# Altium schematic sheet Host_FPGA.SchDoc: Host Controller - Spartan3-1500
size A2; Organization: Altium Limited.; Address1: Level 3, 12a Rodborough Rd; Address2: Frenchs Forest 2086; Address3: NSW; Address4: AUSTRALIA; DocumentNumber: 12; Revision: 6; SheetNumber: 12; SheetTotal: 64; PageSetup: Record=PageOptions|CenterHorizontal=True|CenterVertical=True|PrintScale=0.47|XCorrection=1.00|YCorrection=1.00|PrintKind=0|BorderSize=5000000|LeftOffset=0|BottomOffset=0|Orientation=2|PaperLength=1000|PaperWidth=1000|Scale=100|PaperSource=7|PrintQuality=1200|MediaType=1|DitherType=10|PaperKind=A4 (210 x 297 mm)|PrintScaleMode=1
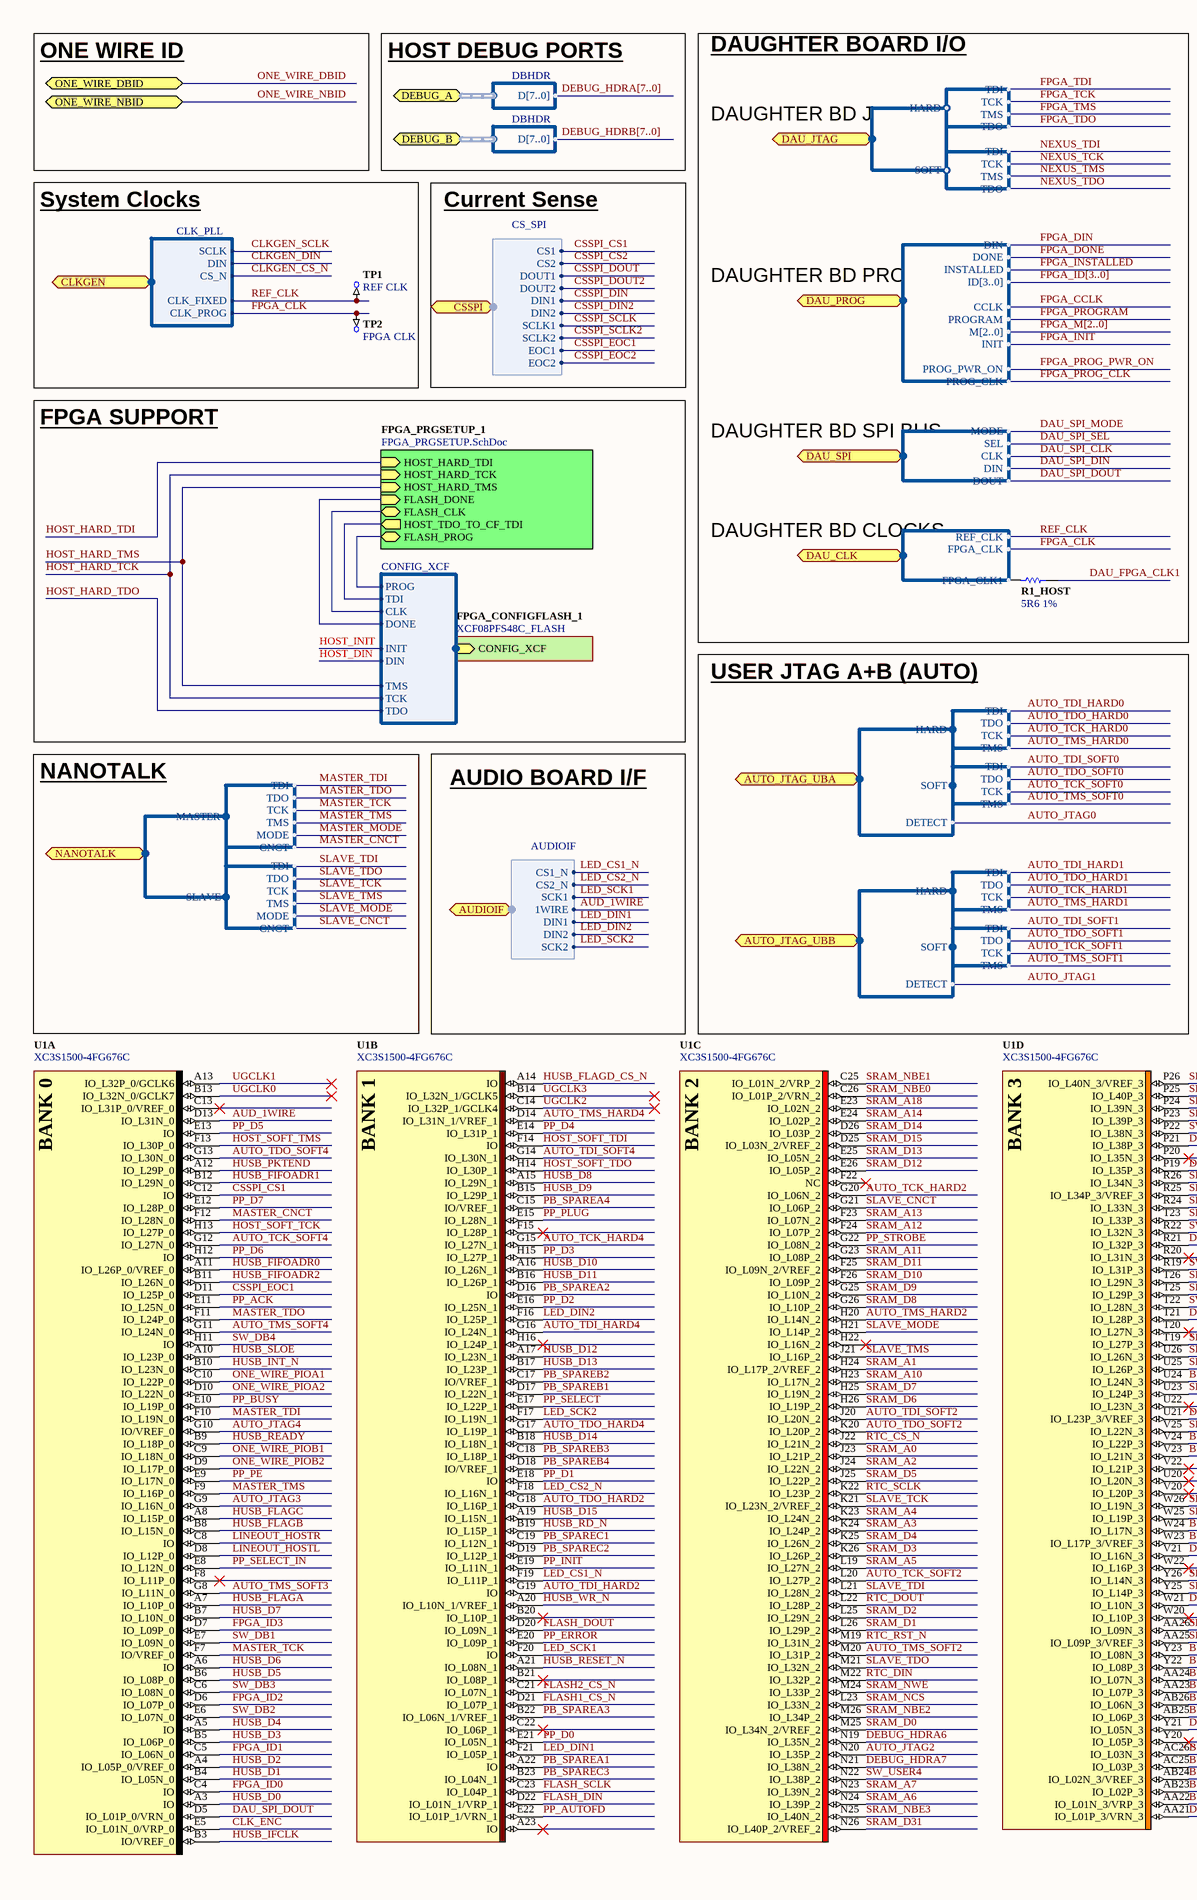
[diagram p0: Host_FPGA.SchDoc, left]
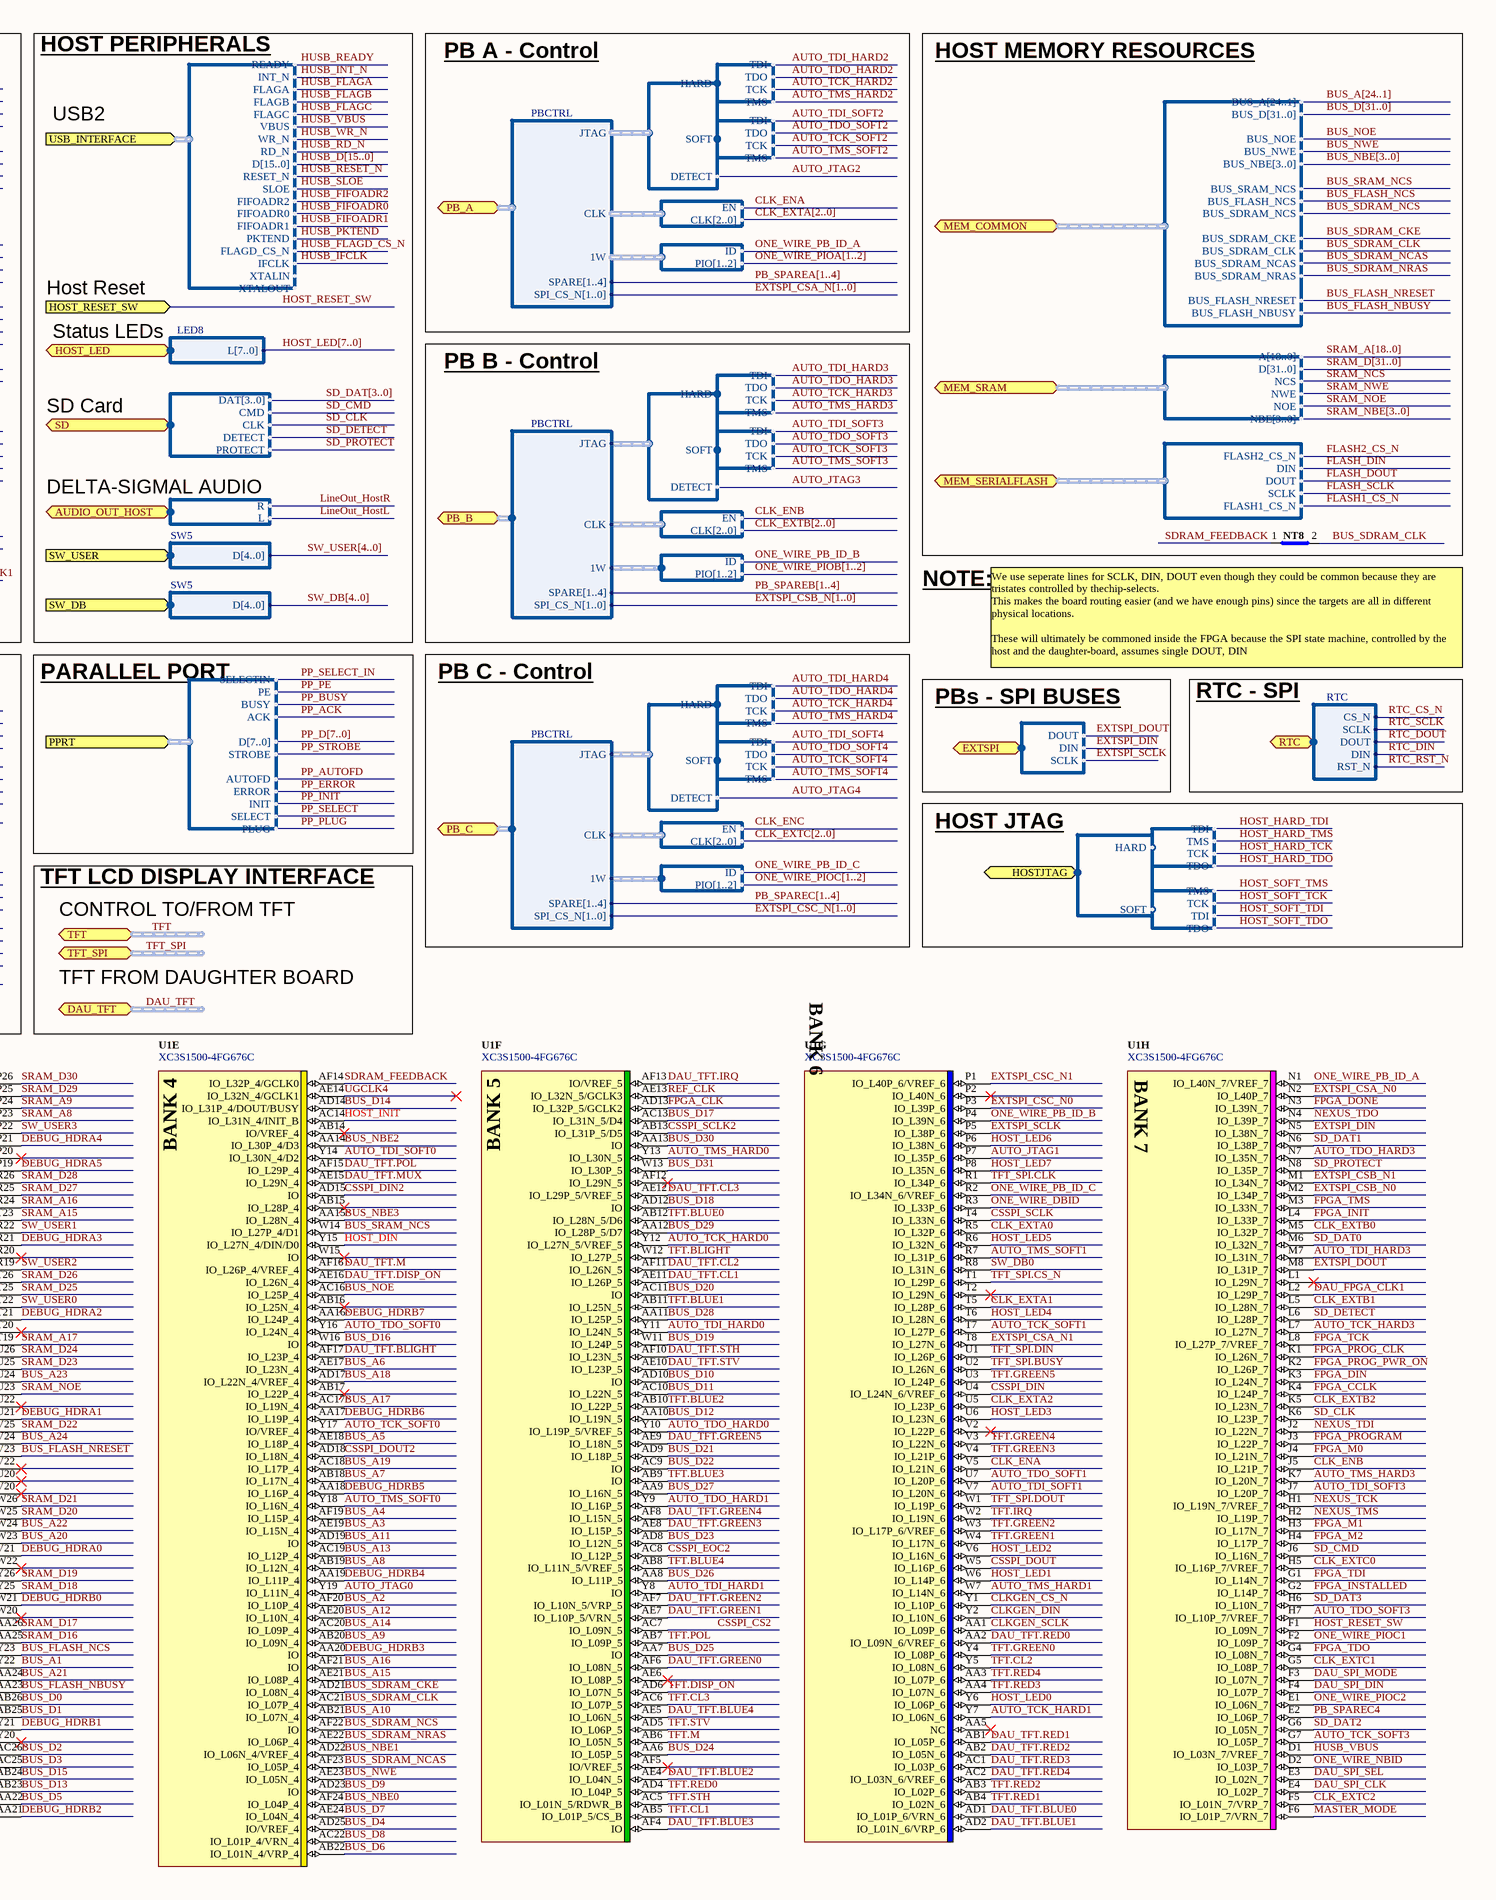
[diagram p1: Host_FPGA.SchDoc, right]

## Parts
NT8  Net Tie SMT2  [NETTIE-SMT2-8X8]  (value not drawn)  (net tie, no BOM)
R1_HOST  5R6 1%  [RESC1005-STAR]
TP1  REF CLK  [TestPin]  (no BOM)
TP2  FPGA CLK  [TestPin]  (no BOM)
U1  XC3S1500-4FG676C  [BGA100P26X26-676]  (parts A,B,C,D,E,F,G,H of 12)

## Blocks framed on the sheet
DAUGHTER BOARD I/O: R1_HOST
HOST MEMORY RESOURCES: NT8
System Clocks: TP1 TP2

## Sub-sheets
FPGA_CONFIGFLASH_1 = XCF08PFS48C_FLASH: CONFIG_XCF (harness CONFIG_XCF)
FPGA_PRGSETUP_1 = FPGA_PRGSETUP.SchDoc: HOST_HARD_TMS (in), HOST_HARD_TDI (in), HOST_HARD_TCK (in), HOST_TDO_TO_CF_TDI (out), FLASH_PROG (bidir), FLASH_CLK (bidir), FLASH_DONE (in)

## Ports
AUDIO_OUT_HOST (harness AUDIO_OUT), AUDIOIF (harness AUDIOIF), AUTO_JTAG_UBA (harness JTAG_CONFIG), AUTO_JTAG_UBB (harness JTAG_CONFIG), CLKGEN (harness CLK_PLL), CSSPI (harness CS_SPI), DAU_CLK (harness DAU_CLK), DAU_JTAG (harness HARDSOFT_JTAG), DAU_PROG (harness DAU_CTRL), DAU_SPI (harness DAU_SPI), DAU_TFT (harness DAU_TFT), DEBUG_A (harness DBHDR), DEBUG_B (harness DBHDR), EXTSPI (harness EXTSPI), HOST_LED (harness LED8), HOST_RESET_SW (in), HOSTJTAG (harness HARDSOFT_JTAG), MEM_COMMON (harness HOSTMEMORY), MEM_SERIALFLASH (harness SERIALFLASH), MEM_SRAM (harness SRAM_2), NANOTALK (harness NANOTALK), ONE_WIRE_DBID (bidir), ONE_WIRE_NBID (bidir), PB_A (harness PBCTRL), PB_B (harness PBCTRL), PB_C (harness PBCTRL), PPRT (harness PPORT_INTF), RTC (harness RTC), SD (harness SD), SW_DB (harness SW5), SW_USER (harness SW5), TFT (harness TFT), TFT_SPI (harness TFT_SPI), USB_INTERFACE (harness USB_INTF)

## Harnesses
SERIALFLASH: FLASH2_CS_N, DIN, DOUT, SCLK, FLASH1_CS_N
SRAM_2: A[18..0], D[31..0], NCS, NWE, NOE, NBE[3..0]
HOSTMEMORY: BUS_A[24..1], BUS_D[31..0], BUS_NOE, BUS_NWE, BUS_NBE[3..0], BUS_SRAM_NCS, BUS_FLASH_NCS, BUS_SDRAM_NCS, BUS_SDRAM_CKE, BUS_SDRAM_CLK, BUS_SDRAM_NCAS, BUS_SDRAM_NRAS, BUS_FLASH_NRESET, BUS_FLASH_NBUSY
DAU_CLK: REF_CLK, FPGA_CLK, FPGA_CLK1
DAU_SPI: MODE, SEL, CLK, DIN, DOUT
DAU_CTRL: DIN, DONE, INSTALLED, ID[3..0], CCLK, PROGRAM, M[2..0], INIT, PROG_PWR_ON, PROG_CLK
JTAG: TMS, TDO, TDI, TCK
HARDSOFT_JTAG: HARD, SOFT
NANOTALK: MASTER, SLAVE
NANOTALK_JTAG: TDI, TCK, TMS, TDO, MODE, CNCT
SD: DAT[3..0], CMD, CLK, DETECT, PROTECT
JTAG_CONFIG: HARD, SOFT, DETECT
JTAG: TDI, TDO, TCK, TMS
AUDIO_OUT: R, L
EXTSPI: DOUT, DIN, SCLK
GATE_CLOCKS: EN, CLK[2..0]
ONE_WIRE: ID, PIO[1..2]
PPORT_INTF: SELECTIN, PE, BUSY, ACK, STROBE, AUTOFD, ERROR, INIT, SELECT, PLUG, D[7..0]
USB_INTF: READY, INT_N, SLOE, FIFOADR2, FIFOADR0, FIFOADR1, PKTEND, FLAGD_CS_N, FLAGA, FLAGB, FLAGC, WR_N, RD_N, D[15..0], RESET_N, IFCLK, XTALIN, VBUS, XTALOUT
RTC: CS_N, DIN, DOUT, RST_N, SCLK
CLK_PLL: CLK_FIXED, CLK_PROG, CS_N, DIN, SCLK
DBHDR: D[7..0]
LED8: L[7..0]
SW5: D[4..0]
PBCTRL: JTAG, CLK, 1W, SPI_CS_N[1..0], SPARE[1..4]
CONFIG_XCF: DONE, CLK, TMS, DIN, TDO, PROG, INIT, TCK, TDI
AUDIOIF: CS1_N, CS2_N, SCK1, 1WIRE, DIN1, DIN2, SCK2
CS_SPI: CS2, DOUT1, DOUT2, DIN1, CS1, DIN2, SCLK1, EOC1, SCLK2, EOC2

## Nets
AUD_1WIRE: U1.D13(IO_L31N_0) ; port AUDIOIF.1WIRE
AUTO_JTAG0: U1.Y19(IO_L11N_4) ; port AUTO_JTAG_UBA.DETECT
AUTO_JTAG1: U1.P7(IO_L35P_6) ; port AUTO_JTAG_UBB.DETECT
AUTO_JTAG2: U1.N20(IO_L35P_2) ; harness JTAG_CONFIG.DETECT
AUTO_JTAG3: U1.G9(IO_L16N_0) ; harness JTAG_CONFIG.DETECT
AUTO_JTAG4: U1.G10(IO/VREF_0) ; harness JTAG_CONFIG.DETECT
AUTO_TCK_HARD0: U1.Y12(IO_L27N_5/VREF_5) ; harness JTAG.TCK
AUTO_TCK_HARD1: U1.Y7(IO_L06N_6) ; harness JTAG.TCK
AUTO_TCK_HARD2: U1.G20(IO_L06N_2) ; harness JTAG.TCK
AUTO_TCK_HARD3: U1.L7(IO_L27N_7) ; harness JTAG.TCK
AUTO_TCK_HARD4: U1.G15(IO_L27N_1) ; harness JTAG.TCK
AUTO_TCK_SOFT0: U1.Y17(IO/VREF_4) ; harness JTAG.TCK
AUTO_TCK_SOFT1: U1.T7(IO_L27P_6) ; harness JTAG.TCK
AUTO_TCK_SOFT2: U1.L20(IO_L27P_2) ; harness JTAG.TCK
AUTO_TCK_SOFT3: U1.G7(IO_L05P_7) ; harness JTAG.TCK
AUTO_TCK_SOFT4: U1.G12(IO_L27N_0) ; harness JTAG.TCK
AUTO_TDI_HARD0: U1.Y11(IO_L24N_5) ; harness JTAG.TDI
AUTO_TDI_HARD1: U1.Y8(IO) ; harness JTAG.TDI
AUTO_TDI_HARD2: U1.G19(IO) ; harness JTAG.TDI
AUTO_TDI_HARD3: U1.M7(IO_L31N_7) ; harness JTAG.TDI
AUTO_TDI_HARD4: U1.G16(IO_L24N_1) ; harness JTAG.TDI
AUTO_TDI_SOFT0: U1.Y14(IO_L30N_4/D2) ; harness JTAG.TDI
AUTO_TDI_SOFT1: U1.V7(IO_L20N_6) ; harness JTAG.TDI
AUTO_TDI_SOFT2: U1.J20(IO_L20N_2) ; harness JTAG.TDI
AUTO_TDI_SOFT3: U1.J7(IO_L20P_7) ; harness JTAG.TDI
AUTO_TDI_SOFT4: U1.G14(IO_L30N_1) ; harness JTAG.TDI
AUTO_TDO_HARD0: U1.Y10(IO_L19P_5/VREF_5) ; harness JTAG.TDO
AUTO_TDO_HARD1: U1.Y9(IO_L16P_5) ; harness JTAG.TDO
AUTO_TDO_HARD2: U1.G18(IO_L16P_1) ; harness JTAG.TDO
AUTO_TDO_HARD3: U1.N7(IO_L35N_7) ; harness JTAG.TDO
AUTO_TDO_HARD4: U1.G17(IO_L19P_1) ; harness JTAG.TDO
AUTO_TDO_SOFT0: U1.Y16(IO_L24N_4) ; harness JTAG.TDO
AUTO_TDO_SOFT1: U1.U7(IO_L20P_6) ; harness JTAG.TDO
AUTO_TDO_SOFT2: U1.K20(IO_L20P_2) ; harness JTAG.TDO
AUTO_TDO_SOFT3: U1.H7(IO_L10P_7/VREF_7) ; harness JTAG.TDO
AUTO_TDO_SOFT4: U1.G13(IO_L30N_0) ; harness JTAG.TDO
AUTO_TMS_HARD0: U1.Y13(IO_L30N_5) ; harness JTAG.TMS
AUTO_TMS_HARD1: U1.W7(IO_L14N_6) ; harness JTAG.TMS
AUTO_TMS_HARD2: U1.H20(IO_L14N_2) ; harness JTAG.TMS
AUTO_TMS_HARD3: U1.K7(IO_L20N_7) ; harness JTAG.TMS
AUTO_TMS_HARD4: U1.D14(IO_L31N_1/VREF_1) ; harness JTAG.TMS
AUTO_TMS_SOFT0: U1.Y18(IO_L16N_4) ; harness JTAG.TMS
AUTO_TMS_SOFT1: U1.R7(IO_L31P_6) ; harness JTAG.TMS
AUTO_TMS_SOFT2: U1.M20(IO_L31P_2) ; harness JTAG.TMS
AUTO_TMS_SOFT3: U1.G8(IO_L11N_0) ; harness JTAG.TMS
AUTO_TMS_SOFT4: U1.G11(IO_L24N_0) ; harness JTAG.TMS
BUS_A1: U1.Y22(IO_L08P_3)
BUS_A2: U1.AF20(IO_L10P_4)
BUS_A3: U1.AE19(IO_L15N_4)
BUS_A4: U1.AF19(IO_L15P_4)
BUS_A5: U1.AE18(IO_L18P_4)
BUS_A6: U1.AE17(IO_L23N_4)
BUS_A7: U1.AB18(IO_L17N_4)
BUS_A8: U1.AB19(IO_L12N_4)
BUS_A9: U1.AB20(IO_L09N_4)
BUS_A10: U1.AB21(IO_L07N_4)
BUS_A11: U1.AD19(IO)
BUS_A12: U1.AE20(IO_L10N_4)
BUS_A13: U1.AC19(IO_L12P_4)
BUS_A14: U1.AC20(IO_L09P_4)
BUS_A15: U1.AE21(IO_L08P_4)
BUS_A16: U1.AF21(IO)
BUS_A17: U1.AC17(IO_L19N_4)
BUS_A18: U1.AD17(IO_L22N_4/VREF_4)
BUS_A19: U1.AC18(IO_L17P_4)
BUS_A20: U1.W23(IO_L17P_3/VREF_3)
BUS_A21: U1.AA24(IO_L07N_3)
BUS_A22: U1.W24(IO_L17N_3)
BUS_A23: U1.U24(IO_L24N_3)
BUS_A24: U1.V24(IO_L22P_3)
BUS_D0: U1.AB26(IO_L06N_3)
BUS_D1: U1.AB25(IO_L06P_3)
BUS_D2: U1.AC26(IO_L03N_3)
BUS_D3: U1.AC25(IO_L03P_3)
BUS_D4: U1.AD25(IO/VREF_4)
BUS_D5: U1.AA22(IO_L01N_3/VRP_3)
BUS_D6: U1.AB22(IO_L01N_4/VRP_4)
BUS_D7: U1.AE24(IO_L04N_4)
BUS_D8: U1.AC22(IO_L01P_4/VRN_4)
BUS_D9: U1.AD23(IO)
BUS_D10: U1.AD10(IO)
BUS_D11: U1.AC10(IO_L22N_5)
BUS_D12: U1.AA10(IO_L19N_5)
BUS_D13: U1.AB23(IO_L02P_3)
BUS_D14: U1.AD14(IO_L31P_4/DOUT/BUSY)
BUS_D15: U1.AB24(IO_L02N_3/VREF_3)
BUS_D16: U1.W16(IO)
BUS_D17: U1.AC13(IO_L31N_5/D4)
BUS_D18: U1.AD12(IO)
BUS_D19: U1.W11(IO_L24P_5)
BUS_D20: U1.AC11(IO)
BUS_D21: U1.AD9(IO_L18P_5)
BUS_D22: U1.AC9(IO)
BUS_D23: U1.AD8(IO_L12N_5)
BUS_D24: U1.AA6(IO_L05P_5)
BUS_D25: U1.AA7(IO)
BUS_D26: U1.AA8(IO_L11P_5)
BUS_D27: U1.AA9(IO_L16N_5)
BUS_D28: U1.AA11(IO_L25P_5)
BUS_D29: U1.AA12(IO_L28P_5/D7)
BUS_D30: U1.AA13(IO)
BUS_D31: U1.W13(IO_L30P_5)
BUS_FLASH_NBUSY: U1.AA23(IO_L07P_3) ; port MEM_COMMON.BUS_FLASH_NBUSY
BUS_FLASH_NCS: U1.Y23(IO_L08N_3) ; port MEM_COMMON.BUS_FLASH_NCS
BUS_FLASH_NRESET: U1.V23(IO_L21N_3) ; port MEM_COMMON.BUS_FLASH_NRESET
BUS_NBE0: U1.AF24(IO_L04P_4)
BUS_NBE1: U1.AD22(IO_L06N_4/VREF_4)
BUS_NBE2: U1.AA14(IO_L30P_4/D3)
BUS_NBE3: U1.AA15(IO_L28N_4)
BUS_NOE: U1.AC16(IO_L25P_4) ; port MEM_COMMON.BUS_NOE
BUS_NWE: U1.AE23(IO_L05N_4) ; port MEM_COMMON.BUS_NWE
BUS_SDRAM_CKE: U1.AD21(IO_L08N_4) ; port MEM_COMMON.BUS_SDRAM_CKE
BUS_SDRAM_CLK: NT8.2(Net2) U1.AC21(IO_L07P_4) ; port MEM_COMMON.BUS_SDRAM_CLK
BUS_SDRAM_NCAS: U1.AF23(IO_L05P_4) ; port MEM_COMMON.BUS_SDRAM_NCAS
BUS_SDRAM_NCS: U1.AF22(IO) ; port MEM_COMMON.BUS_SDRAM_NCS
BUS_SDRAM_NRAS: U1.AE22(IO_L06P_4) ; port MEM_COMMON.BUS_SDRAM_NRAS
BUS_SRAM_NCS: U1.W14(IO_L27P_4/D1) ; port MEM_COMMON.BUS_SRAM_NCS
CLK_ENA: U1.V5(IO_L21N_6) ; harness GATE_CLOCKS.EN
CLK_ENB: U1.J5(IO_L21P_7) ; harness GATE_CLOCKS.EN
CLK_ENC: U1.E5(IO_L01N_0/VRP_0) ; harness GATE_CLOCKS.EN
CLK_EXTA0: U1.R5(IO_L32P_6)
CLK_EXTA1: U1.T5(IO_L28P_6)
CLK_EXTA2: U1.U5(IO_L23P_6)
CLK_EXTB0: U1.M5(IO_L32P_7)
CLK_EXTB1: U1.L5(IO_L28N_7)
CLK_EXTB2: U1.K5(IO_L23N_7)
CLK_EXTC0: U1.H5(IO_L16P_7/VREF_7)
CLK_EXTC1: U1.G5(IO_L08P_7)
CLK_EXTC2: U1.F5(IO_L01N_7/VRP_7)
CLKGEN_CS_N: U1.Y1(IO_L10P_6) ; port CLKGEN.CS_N
CLKGEN_DIN: U1.Y2(IO_L10N_6) ; port CLKGEN.DIN
CLKGEN_SCLK: U1.AA1(IO_L09P_6) ; port CLKGEN.SCLK
CSSPI_CS1: U1.C12(IO) ; port CSSPI.CS1
CSSPI_CS2: U1.AC7(IO_L09N_5) ; port CSSPI.CS2
CSSPI_DIN: U1.U4(IO_L24N_6/VREF_6) ; port CSSPI.DIN1
CSSPI_DIN2: U1.AD15(IO) ; port CSSPI.DIN2
CSSPI_DOUT: U1.W5(IO_L16P_6) ; port CSSPI.DOUT1
CSSPI_DOUT2: U1.AD18(IO_L18N_4) ; port CSSPI.DOUT2
CSSPI_EOC1: U1.D11(IO_L25P_0) ; port CSSPI.EOC1
CSSPI_EOC2: U1.AC8(IO_L12P_5) ; port CSSPI.EOC2
CSSPI_SCLK: U1.T4(IO_L33N_6) ; port CSSPI.SCLK1
CSSPI_SCLK2: U1.AB13(IO_L31P_5/D5) ; port CSSPI.SCLK2
DAU_FPGA_CLK1: R1_HOST.1 U1.L2(IO_L29P_7)
DAU_SPI_CLK: U1.E4(IO_L02P_7) ; port DAU_SPI.CLK
DAU_SPI_DIN: U1.F4(IO_L07P_7) ; port DAU_SPI.DIN
DAU_SPI_DOUT: U1.D5(IO_L01P_0/VRN_0) ; port DAU_SPI.DOUT
DAU_SPI_MODE: U1.F3(IO_L07N_7) ; port DAU_SPI.MODE
DAU_SPI_SEL: U1.E3(IO_L02N_7) ; port DAU_SPI.SEL
DAU_TFT.BLIGHT: U1.AF17(IO_L23P_4)
DAU_TFT.BLUE0: U1.AD1(IO_L01P_6/VRN_6)
DAU_TFT.BLUE1: U1.AD2(IO_L01N_6/VRP_6)
DAU_TFT.BLUE2: U1.AE4(IO_L04N_5)
DAU_TFT.BLUE3: U1.AF4(IO)
DAU_TFT.BLUE4: U1.AE5(IO_L06N_5)
DAU_TFT.CL1: U1.AE11(IO_L26P_5)
DAU_TFT.CL2: U1.AF11(IO_L26N_5)
DAU_TFT.CL3: U1.AE12(IO_L29P_5/VREF_5)
DAU_TFT.DISP_ON: U1.AE16(IO_L26N_4)
DAU_TFT.GREEN0: U1.AF6(IO_L08N_5)
DAU_TFT.GREEN1: U1.AE7(IO_L10P_5/VRN_5)
DAU_TFT.GREEN2: U1.AF7(IO_L10N_5/VRP_5)
DAU_TFT.GREEN3: U1.AE8(IO_L15P_5)
DAU_TFT.GREEN4: U1.AF8(IO_L15N_5)
DAU_TFT.GREEN5: U1.AE9(IO_L18N_5)
DAU_TFT.IRQ: U1.AF13(IO/VREF_5)
DAU_TFT.M: U1.AF16(IO_L26P_4/VREF_4)
DAU_TFT.MUX: U1.AE15(IO_L29N_4)
DAU_TFT.POL: U1.AF15(IO_L29P_4)
DAU_TFT.RED0: U1.AA2(IO_L09N_6/VREF_6)
DAU_TFT.RED1: U1.AB1(IO_L05P_6)
DAU_TFT.RED2: U1.AB2(IO_L05N_6)
DAU_TFT.RED3: U1.AC1(IO_L03P_6)
DAU_TFT.RED4: U1.AC2(IO_L03N_6/VREF_6)
DAU_TFT.STH: U1.AF10(IO_L23N_5)
DAU_TFT.STV: U1.AE10(IO_L23P_5)
DEBUG_HDRA0: U1.V21(IO_L16N_3)
DEBUG_HDRA1: U1.U21(IO_L23P_3/VREF_3)
DEBUG_HDRA2: U1.T21(IO_L28P_3)
DEBUG_HDRA3: U1.R21(IO_L32P_3)
DEBUG_HDRA4: U1.P21(IO_L38P_3)
DEBUG_HDRA5: U1.P19(IO_L35P_3)
DEBUG_HDRA6: U1.N19(IO_L35N_2)
DEBUG_HDRA7: U1.N21(IO_L38N_2)
DEBUG_HDRB0: U1.W21(IO_L10N_3)
DEBUG_HDRB1: U1.Y21(IO_L05N_3)
DEBUG_HDRB2: U1.AA21(IO_L01P_3/VRN_3)
DEBUG_HDRB3: U1.AA20(IO)
DEBUG_HDRB4: U1.AA19(IO_L11P_4)
DEBUG_HDRB5: U1.AA18(IO_L16P_4)
DEBUG_HDRB6: U1.AA17(IO_L19P_4)
DEBUG_HDRB7: U1.AA16(IO_L24P_4)
EXTSPI_CSA_N0: U1.N2(IO_L40P_7)
EXTSPI_CSA_N1: U1.T8(IO_L27N_6)
EXTSPI_CSB_N0: U1.M2(IO_L34P_7)
EXTSPI_CSB_N1: U1.M1(IO_L34N_7)
EXTSPI_CSC_N0: U1.P3(IO_L39P_6)
EXTSPI_CSC_N1: U1.P1(IO_L40P_6/VREF_6)
EXTSPI_DIN: U1.N5(IO_L38N_7) ; port EXTSPI.DIN
EXTSPI_DOUT: U1.M8(IO_L31P_7) ; port EXTSPI.DOUT
EXTSPI_SCLK: U1.P5(IO_L38P_6) ; port EXTSPI.SCLK
FLASH1_CS_N: U1.D21(IO_L07P_1) ; port MEM_SERIALFLASH.FLASH1_CS_N
FLASH2_CS_N: U1.C21(IO_L07N_1) ; port MEM_SERIALFLASH.FLASH2_CS_N
FLASH_DIN: U1.D22(IO_L01N_1/VRP_1) ; port MEM_SERIALFLASH.DIN
FLASH_DOUT: U1.D20(IO_L09N_1) ; port MEM_SERIALFLASH.DOUT
FLASH_SCLK: U1.C23(IO_L04P_1) ; port MEM_SERIALFLASH.SCLK
FPGA_CCLK: U1.K4(IO_L24P_7) ; port DAU_PROG.CCLK
FPGA_CLK: TP2.1 U1.AD13(IO_L32P_5/GCLK2) ; port DAU_CLK.FPGA_CLK, port CLKGEN.CLK_PROG
FPGA_DIN: U1.K3(IO_L24N_7) ; port DAU_PROG.DIN
FPGA_DONE: U1.N3(IO_L39N_7) ; port DAU_PROG.DONE
FPGA_ID0: U1.C4(IO)
FPGA_ID1: U1.C5(IO_L06N_0)
FPGA_ID2: U1.D6(IO_L07P_0)
FPGA_ID3: U1.D7(IO_L09P_0)
FPGA_INIT: U1.L4(IO_L33P_7) ; port DAU_PROG.INIT
FPGA_INSTALLED: U1.G2(IO_L14P_7) ; port DAU_PROG.INSTALLED
FPGA_M0: U1.J4(IO_L21N_7)
FPGA_M1: U1.H3(IO_L17N_7)
FPGA_M2: U1.H4(IO_L17P_7)
FPGA_PROG_CLK: U1.K1(IO_L26N_7) ; port DAU_PROG.PROG_CLK
FPGA_PROG_PWR_ON: U1.K2(IO_L26P_7) ; port DAU_PROG.PROG_PWR_ON
FPGA_PROGRAM: U1.J3(IO_L22P_7) ; port DAU_PROG.PROGRAM
FPGA_TCK: U1.L8(IO_L27P_7/VREF_7) ; harness JTAG.TCK
FPGA_TDI: U1.G1(IO_L14N_7) ; harness JTAG.TDI
FPGA_TDO: U1.G4(IO_L08N_7) ; harness JTAG.TDO
FPGA_TMS: U1.M3(IO_L33N_7) ; harness JTAG.TMS
HOST_DIN: U1.Y15(IO_L27N_4/DIN/D0) ; sheet FPGA_CONFIGFLASH_1/CONFIG_XCF.DIN
HOST_HARD_TCK: sheet FPGA_PRGSETUP_1/HOST_HARD_TCK, harness JTAG.TCK, sheet FPGA_CONFIGFLASH_1/CONFIG_XCF.TCK
HOST_HARD_TDI: sheet FPGA_PRGSETUP_1/HOST_HARD_TDI, harness JTAG.TDI
HOST_HARD_TDO: harness JTAG.TDO, sheet FPGA_CONFIGFLASH_1/CONFIG_XCF.TDO
HOST_HARD_TMS: sheet FPGA_PRGSETUP_1/HOST_HARD_TMS, harness JTAG.TMS, sheet FPGA_CONFIGFLASH_1/CONFIG_XCF.TMS
HOST_INIT: U1.AC14(IO_L31N_4/INIT_B) ; sheet FPGA_CONFIGFLASH_1/CONFIG_XCF.INIT
HOST_LED0: U1.Y6(IO_L06P_6)
HOST_LED1: U1.W6(IO_L14P_6)
HOST_LED2: U1.V6(IO_L16N_6)
HOST_LED3: U1.U6(IO_L23N_6)
HOST_LED4: U1.T6(IO_L28N_6)
HOST_LED5: U1.R6(IO_L32N_6)
HOST_LED6: U1.P6(IO_L38N_6)
HOST_LED7: U1.P8(IO_L35N_6)
HOST_RESET_SW: U1.F1(IO_L09N_7) ; port HOST_RESET_SW
HOST_SOFT_TCK: U1.H13(IO_L27P_0) ; harness JTAG.TCK
HOST_SOFT_TDI: U1.F14(IO) ; harness JTAG.TDI
HOST_SOFT_TDO: U1.H14(IO_L30P_1) ; harness JTAG.TDO
HOST_SOFT_TMS: U1.F13(IO_L30P_0) ; harness JTAG.TMS
HUSB_D0: U1.A3(IO)
HUSB_D1: U1.B4(IO_L05N_0)
HUSB_D2: U1.A4(IO_L05P_0/VREF_0)
HUSB_D3: U1.B5(IO_L06P_0)
HUSB_D4: U1.A5(IO)
HUSB_D5: U1.B6(IO_L08P_0)
HUSB_D6: U1.A6(IO)
HUSB_D7: U1.B7(IO_L10N_0)
HUSB_D8: U1.A15(IO_L29N_1)
HUSB_D9: U1.B15(IO_L29P_1)
HUSB_D10: U1.A16(IO_L26N_1)
HUSB_D11: U1.B16(IO_L26P_1)
HUSB_D12: U1.A17(IO_L23N_1)
HUSB_D13: U1.B17(IO_L23P_1)
HUSB_D14: U1.B18(IO_L18N_1)
HUSB_D15: U1.A19(IO_L15N_1)
HUSB_FIFOADR0: U1.A11(IO_L26P_0/VREF_0) ; port USB_INTERFACE.FIFOADR0
HUSB_FIFOADR1: U1.B12(IO_L29N_0) ; port USB_INTERFACE.FIFOADR1
HUSB_FIFOADR2: U1.B11(IO_L26N_0) ; port USB_INTERFACE.FIFOADR2
HUSB_FLAGA: U1.A7(IO_L10P_0) ; port USB_INTERFACE.FLAGA
HUSB_FLAGB: U1.B8(IO_L15N_0) ; port USB_INTERFACE.FLAGB
HUSB_FLAGC: U1.A8(IO_L15P_0) ; port USB_INTERFACE.FLAGC
HUSB_FLAGD_CS_N: U1.A14(IO) ; port USB_INTERFACE.FLAGD_CS_N
HUSB_IFCLK: U1.B3(IO/VREF_0) ; port USB_INTERFACE.IFCLK
HUSB_INT_N: U1.B10(IO_L23N_0) ; port USB_INTERFACE.INT_N
HUSB_PKTEND: U1.A12(IO_L29P_0) ; port USB_INTERFACE.PKTEND
HUSB_RD_N: U1.B19(IO_L15P_1) ; port USB_INTERFACE.RD_N
HUSB_READY: U1.B9(IO_L18P_0) ; port USB_INTERFACE.READY
HUSB_RESET_N: U1.A21(IO_L08N_1) ; port USB_INTERFACE.RESET_N
HUSB_SLOE: U1.A10(IO_L23P_0) ; port USB_INTERFACE.SLOE
HUSB_VBUS: U1.D1(IO_L03N_7/VREF_7) ; port USB_INTERFACE.VBUS
HUSB_WR_N: U1.A20(IO_L10N_1/VREF_1) ; port USB_INTERFACE.WR_N
LED_CS1_N: U1.F19(IO_L11P_1) ; port AUDIOIF.CS1_N
LED_CS2_N: U1.F18(IO_L16N_1) ; port AUDIOIF.CS2_N
LED_DIN1: U1.F21(IO_L05P_1) ; port AUDIOIF.DIN1
LED_DIN2: U1.F16(IO_L25P_1) ; port AUDIOIF.DIN2
LED_SCK1: U1.F20(IO) ; port AUDIOIF.SCK1
LED_SCK2: U1.F17(IO_L19N_1) ; port AUDIOIF.SCK2
LINEOUT_HOSTL: U1.D8(IO_L12P_0) ; port AUDIO_OUT_HOST.L
LINEOUT_HOSTR: U1.C8(IO) ; port AUDIO_OUT_HOST.R
MASTER_CNCT: U1.F12(IO_L28N_0) ; harness NANOTALK_JTAG.CNCT
MASTER_MODE: U1.F6(IO_L01P_7/VRN_7) ; harness NANOTALK_JTAG.MODE
MASTER_TCK: U1.F7(IO/VREF_0) ; harness NANOTALK_JTAG.TCK
MASTER_TDI: U1.F10(IO_L19N_0) ; harness NANOTALK_JTAG.TDI
MASTER_TDO: U1.F11(IO_L24P_0) ; harness NANOTALK_JTAG.TDO
MASTER_TMS: U1.F9(IO_L16P_0) ; harness NANOTALK_JTAG.TMS
NEXUS_TCK: U1.H1(IO_L19N_7/VREF_7) ; harness JTAG.TCK
NEXUS_TDI: U1.J2(IO_L22N_7) ; harness JTAG.TDI
NEXUS_TDO: U1.N4(IO_L39P_7) ; harness JTAG.TDO
NEXUS_TMS: U1.H2(IO_L19P_7) ; harness JTAG.TMS
ONE_WIRE_DBID: U1.R3(IO_L33P_6) ; port ONE_WIRE_DBID
ONE_WIRE_NBID: U1.D2(IO_L03P_7) ; port ONE_WIRE_NBID
ONE_WIRE_PB_ID_A: U1.N1(IO_L40N_7/VREF_7) ; harness ONE_WIRE.ID
ONE_WIRE_PB_ID_B: U1.P4(IO_L39N_6) ; harness ONE_WIRE.ID
ONE_WIRE_PB_ID_C: U1.R2(IO_L34N_6/VREF_6) ; harness ONE_WIRE.ID
ONE_WIRE_PIOA1: U1.C10(IO_L22P_0)
ONE_WIRE_PIOA2: U1.D10(IO_L22N_0)
ONE_WIRE_PIOB1: U1.C9(IO_L18N_0)
ONE_WIRE_PIOB2: U1.D9(IO_L17P_0)
ONE_WIRE_PIOC1: U1.F2(IO_L09P_7)
ONE_WIRE_PIOC2: U1.E1(IO_L06N_7)
PB_SPAREA1: U1.A22(IO)
PB_SPAREA2: U1.D16(IO)
PB_SPAREA3: U1.B22(IO_L06N_1/VREF_1)
PB_SPAREA4: U1.C15(IO/VREF_1)
PB_SPAREB1: U1.D17(IO_L22N_1)
PB_SPAREB2: U1.C17(IO/VREF_1)
PB_SPAREB3: U1.C18(IO_L18P_1)
PB_SPAREB4: U1.D18(IO/VREF_1)
PB_SPAREC1: U1.C19(IO_L12N_1)
PB_SPAREC2: U1.D19(IO_L12P_1)
PB_SPAREC3: U1.B23(IO_L04N_1)
PB_SPAREC4: U1.E2(IO_L06P_7)
PP_ACK: U1.E11(IO_L25N_0) ; port PPRT.ACK
PP_AUTOFD: U1.E22(IO_L01P_1/VRN_1) ; port PPRT.AUTOFD
PP_BUSY: U1.E10(IO_L19P_0) ; port PPRT.BUSY
PP_D0: U1.E21(IO_L05N_1)
PP_D1: U1.E18(IO)
PP_D2: U1.E16(IO_L25N_1)
PP_D3: U1.H15(IO_L27P_1)
PP_D4: U1.E14(IO_L31P_1)
PP_D5: U1.E13(IO)
PP_D6: U1.H12(IO)
PP_D7: U1.E12(IO_L28P_0)
PP_ERROR: U1.E20(IO_L09P_1) ; port PPRT.ERROR
PP_INIT: U1.E19(IO_L11N_1) ; port PPRT.INIT
PP_PE: U1.E9(IO_L17N_0) ; port PPRT.PE
PP_PLUG: U1.E15(IO_L28N_1) ; port PPRT.PLUG
PP_SELECT: U1.E17(IO_L22P_1) ; port PPRT.SELECT
PP_SELECT_IN: U1.E8(IO_L12N_0) ; port PPRT.SELECTIN
PP_STROBE: U1.G22(IO_L08N_2) ; port PPRT.STROBE
REF_CLK: TP1.1 U1.AE13(IO_L32N_5/GCLK3) ; port DAU_CLK.REF_CLK, port CLKGEN.CLK_FIXED
RTC_CS_N: U1.J22(IO_L21N_2) ; port RTC.CS_N
RTC_DIN: U1.M22(IO_L32P_2) ; port RTC.DIN
RTC_DOUT: U1.L22(IO_L28P_2) ; port RTC.DOUT
RTC_RST_N: U1.M19(IO_L31N_2) ; port RTC.RST_N
RTC_SCLK: U1.K22(IO_L23P_2) ; port RTC.SCLK
SD_CLK: U1.K6(IO_L23P_7) ; port SD.CLK
SD_CMD: U1.J6(IO_L16N_7) ; port SD.CMD
SD_DAT0: U1.M6(IO_L32N_7)
SD_DAT1: U1.N6(IO_L38P_7)
SD_DAT2: U1.G6(IO_L05N_7)
SD_DAT3: U1.H6(IO_L10N_7)
SD_DETECT: U1.L6(IO_L28P_7) ; port SD.DETECT
SD_PROTECT: U1.N8(IO_L35P_7) ; port SD.PROTECT
SDRAM_FEEDBACK: NT8.1(Net1) U1.AF14(IO_L32P_4/GCLK0)
SLAVE_CNCT: U1.G21(IO_L06P_2) ; harness NANOTALK_JTAG.CNCT
SLAVE_MODE: U1.H21(IO_L14P_2) ; harness NANOTALK_JTAG.MODE
SLAVE_TCK: U1.K21(IO_L23N_2/VREF_2) ; harness NANOTALK_JTAG.TCK
SLAVE_TDI: U1.L21(IO_L28N_2) ; harness NANOTALK_JTAG.TDI
SLAVE_TDO: U1.M21(IO_L32N_2) ; harness NANOTALK_JTAG.TDO
SLAVE_TMS: U1.J21(IO_L16P_2) ; harness NANOTALK_JTAG.TMS
SRAM_A0: U1.J23(IO_L21P_2)
SRAM_A1: U1.H24(IO_L17P_2/VREF_2)
SRAM_A2: U1.J24(IO_L22N_2)
SRAM_A3: U1.K24(IO_L24P_2)
SRAM_A4: U1.K23(IO_L24N_2)
SRAM_A5: U1.L19(IO_L27N_2)
SRAM_A6: U1.N24(IO_L39P_2)
SRAM_A7: U1.N23(IO_L39N_2)
SRAM_A8: U1.P23(IO_L39P_3)
SRAM_A9: U1.P24(IO_L39N_3)
SRAM_A10: U1.H23(IO_L17N_2)
SRAM_A11: U1.G23(IO_L08P_2)
SRAM_A12: U1.F24(IO_L07P_2)
SRAM_A13: U1.F23(IO_L07N_2)
SRAM_A14: U1.E24(IO_L02P_2)
SRAM_A15: U1.T23(IO_L33P_3)
SRAM_A16: U1.R24(IO_L33N_3)
SRAM_A17: U1.T19(IO_L27P_3)
SRAM_A18: U1.E23(IO_L02N_2)
SRAM_D0: U1.M25(IO_L34N_2/VREF_2)
SRAM_D1: U1.L26(IO_L29P_2)
SRAM_D2: U1.L25(IO_L29N_2)
SRAM_D3: U1.K26(IO_L26P_2)
SRAM_D4: U1.K25(IO_L26N_2)
SRAM_D5: U1.J25(IO_L22P_2)
SRAM_D6: U1.H26(IO_L19P_2)
SRAM_D7: U1.H25(IO_L19N_2)
SRAM_D8: U1.G26(IO_L10P_2)
SRAM_D9: U1.G25(IO_L10N_2)
SRAM_D10: U1.F26(IO_L09P_2)
SRAM_D11: U1.F25(IO_L09N_2/VREF_2)
SRAM_D12: U1.E26(IO_L05P_2)
SRAM_D13: U1.E25(IO_L05N_2)
SRAM_D14: U1.D26(IO_L03P_2)
SRAM_D15: U1.D25(IO_L03N_2/VREF_2)
SRAM_D16: U1.AA25(IO_L09P_3/VREF_3)
SRAM_D17: U1.AA26(IO_L09N_3)
SRAM_D18: U1.Y25(IO_L14P_3)
SRAM_D19: U1.Y26(IO_L14N_3)
SRAM_D20: U1.W25(IO_L19P_3)
SRAM_D21: U1.W26(IO_L19N_3)
SRAM_D22: U1.V25(IO_L22N_3)
SRAM_D23: U1.U25(IO_L26P_3)
SRAM_D24: U1.U26(IO_L26N_3)
SRAM_D25: U1.T25(IO_L29P_3)
SRAM_D26: U1.T26(IO_L29N_3)
SRAM_D27: U1.R25(IO_L34P_3/VREF_3)
SRAM_D28: U1.R26(IO_L34N_3)
SRAM_D29: U1.P25(IO_L40P_3)
SRAM_D30: U1.P26(IO_L40N_3/VREF_3)
SRAM_D31: U1.N26(IO_L40P_2/VREF_2)
SRAM_NBE0: U1.C26(IO_L01P_2/VRN_2)
SRAM_NBE1: U1.C25(IO_L01N_2/VRP_2)
SRAM_NBE2: U1.M26(IO_L34P_2)
SRAM_NBE3: U1.N25(IO_L40N_2)
SRAM_NCS: U1.L23(IO_L33N_2) ; port MEM_SRAM.NCS
SRAM_NOE: U1.U23(IO_L24P_3) ; port MEM_SRAM.NOE
SRAM_NWE: U1.M24(IO_L33P_2) ; port MEM_SRAM.NWE
SW_DB0: U1.R8(IO_L31N_6)
SW_DB1: U1.E7(IO_L09N_0)
SW_DB2: U1.E6(IO_L07N_0)
SW_DB3: U1.C6(IO_L08N_0)
SW_DB4: U1.H11(IO)
SW_USER0: U1.T22(IO_L28N_3)
SW_USER1: U1.R22(IO_L32N_3)
SW_USER2: U1.R19(IO_L31P_3)
SW_USER3: U1.P22(IO_L38N_3)
SW_USER4: U1.N22(IO_L38P_2)
TFT.BLIGHT: U1.W12(IO_L27P_5)
TFT.BLUE0: U1.AB12(IO_L28N_5/D6)
TFT.BLUE1: U1.AB11(IO_L25N_5)
TFT.BLUE2: U1.AB10(IO_L22P_5)
TFT.BLUE3: U1.AB9(IO)
TFT.BLUE4: U1.AB8(IO_L11N_5/VREF_5)
TFT.CL1: U1.AB5(IO_L01P_5/CS_B)
TFT.CL2: U1.Y5(IO_L08N_6)
TFT.CL3: U1.AC6(IO_L07P_5)
TFT.DISP_ON: U1.AD6(IO_L07N_5)
TFT.GREEN0: U1.Y4(IO_L08P_6)
TFT.GREEN1: U1.W4(IO_L17N_6)
TFT.GREEN2: U1.W3(IO_L17P_6/VREF_6)
TFT.GREEN3: U1.V4(IO_L21P_6)
TFT.GREEN4: U1.V3(IO_L22N_6)
TFT.GREEN5: U1.U3(IO_L24P_6)
TFT.IRQ: U1.W2(IO_L19N_6)
TFT.M: U1.AB6(IO_L05N_5)
TFT.POL: U1.AB7(IO_L09P_5)
TFT.RED0: U1.AD4(IO_L04P_5)
TFT.RED1: U1.AB4(IO_L02N_6)
TFT.RED2: U1.AB3(IO_L02P_6)
TFT.RED3: U1.AA4(IO_L07N_6)
TFT.RED4: U1.AA3(IO_L07P_6)
TFT.STH: U1.AC5(IO_L01N_5/RDWR_B)
TFT.STV: U1.AD5(IO_L06P_5)
TFT_SPI.BUSY: U1.U2(IO_L26N_6)
TFT_SPI.CLK: U1.R1(IO_L34P_6)
TFT_SPI.CS_N: U1.T1(IO_L29P_6)
TFT_SPI.DIN: U1.U1(IO_L26P_6)
TFT_SPI.DOUT: U1.W1(IO_L19P_6)
UGCLK0: U1.B13(IO_L32N_0/GCLK7)
UGCLK1: U1.A13(IO_L32P_0/GCLK6)
UGCLK2: U1.C14(IO_L32P_1/GCLK4)
UGCLK3: U1.B14(IO_L32N_1/GCLK5)
UGCLK4: U1.AE14(IO_L32N_4/GCLK1)
NetR1_HOST_2: R1_HOST.2 ; port DAU_CLK.FPGA_CLK1
(unnamed): sheet FPGA_PRGSETUP_1/HOST_TDO_TO_CF_TDI, sheet FPGA_CONFIGFLASH_1/CONFIG_XCF.TDI
(unnamed): sheet FPGA_PRGSETUP_1/FLASH_PROG, sheet FPGA_CONFIGFLASH_1/CONFIG_XCF.PROG
(unnamed): sheet FPGA_PRGSETUP_1/FLASH_CLK, sheet FPGA_CONFIGFLASH_1/CONFIG_XCF.CLK
(unnamed): sheet FPGA_PRGSETUP_1/FLASH_DONE, sheet FPGA_CONFIGFLASH_1/CONFIG_XCF.DONE

Not connected (* = marked no-connect by the designer): U1 A23(IO)* AA5(NC)* AB14(IO/VREF_4)* AB15(IO_L28P_4)* AB16(IO_L25N_4)* AB17(IO_L22P_4)* AE6(IO_L08P_5)* AF5(IO/VREF_5)* AF12(IO_L29N_5)* B20(IO_L10P_1)* B21(IO_L08P_1)* C13(IO_L31P_0/VREF_0)* C22(IO_L06P_1)* F8(IO_L11P_0)* F15(IO_L28P_1)* F22(NC)* H16(IO_L24P_1)* H22(IO_L16N_2)* L1(IO_L29N_7)* P2(IO_L40N_6)* P20(IO_L35N_3)* R20(IO_L31N_3)* T2(IO_L29N_6)* T20(IO_L27N_3)* U20(IO_L20N_3)* U22(IO_L23N_3)* V2(IO_L22P_6)* V20(IO_L20P_3)* V22(IO_L21P_3)* W15(IO)* W20(IO_L10P_3)* W22(IO_L16P_3)* Y20(IO_L05P_3)*

## Buses and harness runs
bus BUS_A[24..1]
bus BUS_D[31..0]
bus BUS_NBE[3..0]
bus CLK_EXTA[2..0]
bus CLK_EXTB[2..0]
bus CLK_EXTC[2..0]
bus DEBUG_HDRA[7..0]
bus DEBUG_HDRB[7..0]
bus EXTSPI_CSA_N[1..0]
bus EXTSPI_CSB_N[1..0]
bus EXTSPI_CSC_N[1..0]
bus FPGA_ID[3..0]
bus FPGA_M[2..0]
bus HOST_LED[7..0]
bus HUSB_D[15..0]
bus ONE_WIRE_PIOA[1..2]
bus ONE_WIRE_PIOB[1..2]
bus ONE_WIRE_PIOC[1..2]
bus PB_SPAREA[1..4]
bus PB_SPAREB[1..4]
bus PB_SPAREC[1..4]
bus PP_D[7..0]
bus SD_DAT[3..0]
bus SRAM_A[18..0]
bus SRAM_D[31..0]
bus SRAM_NBE[3..0]
bus SW_DB[4..0]
bus SW_USER[4..0]
harness DAU_TFT = port DAU_TFT
harness TFT = port TFT
harness TFT_SPI = port TFT_SPI

## Notes on the sheet
- ONE WIRE ID
- HOST DEBUG PORTS
- HOST PERIPHERALS
- PB A - Control
- DAUGHTER BD JTAG
- USB2
- Current Sense
- DAUGHTER BD PROGRAM
- Host Reset
- Status LEDs
- PB B - Control
- FPGA SUPPORT
- DAUGHTER BD SPI BUS
- SD Card
- DELTA-SIGMAL AUDIO
- DAUGHTER BD CLOCKS
- NOTE:
- USER JTAG A+B (AUTO)
- PARALLEL PORT
- PB C - Control
- PBs - SPI BUSES
- (near NT8) We use seperate lines for SCLK, DIN, DOUT even though they could be common because they are tristates controlled by thechip-selects.
  This makes the board routing easier (and we have enough pins) since the targets are all in different physical locations.
  These will ultimately be commoned inside the FPGA because the SPI state machine, controlled by the host and the daughter-board, assumes single DOUT, DIN
- RTC - SPI
- NANOTALK
- AUDIO BOARD I/F
- HOST JTAG
- TFT LCD DISPLAY INTERFACE
- CONTROL TO/FROM TFT
- TFT FROM DAUGHTER BOARD
- (in symbol D-241-0001, part A) BANK 0
- (in symbol D-241-0001, part B) BANK 1
- (in symbol D-241-0001, part C) BANK 2
- (in symbol D-241-0001, part D) BANK 3
- (in symbol D-241-0001, part E) BANK 4
- (in symbol D-241-0001, part F) BANK 5
- (in symbol D-241-0001, part G) BANK 6
- (in symbol D-241-0001, part H) BANK 7

## Library data of the parts
NT8 = D-002-0002: Net-Tie, Surface Mount, 2 x 0.4mm x 0.2mm SMT Pads - For 0.2mm Track; Category: Net-Tie; Status: Production
R1_HOST = D-100-0085: Resistor, 5R6 1% 0402 (1005); Power Rating: 63 mW; Resistance: 5.6 R; Category: Resistor; Status: Production; Mounting Technology: Surface Mount; Tolerance: 1 %
TP1 TP2 = D-006-0000: Test Point, PCB Mount with Silkscreen Box; Category: Test-Point; Status: Production
U1 = D-241-0001: FPGA, Xilinx Spartan3-1500 FG676 Speed=4; EnablePinSwap: True; Supply Voltage: mV; Category: IC-FPGA; Mounting Technology: Surface Mount; Status: Production; Technology: None